# Altium schematic sheet Project_Overview.SchDoc
size A4; Organization: Arribada Initiative; Address1: https://github.com/arribada; Address2: contact@arribada.org; Address3: arribada.org; Address4: UK - Portsmouth; DocumentNumber: 1; SheetNumber: 1; SheetTotal: 12
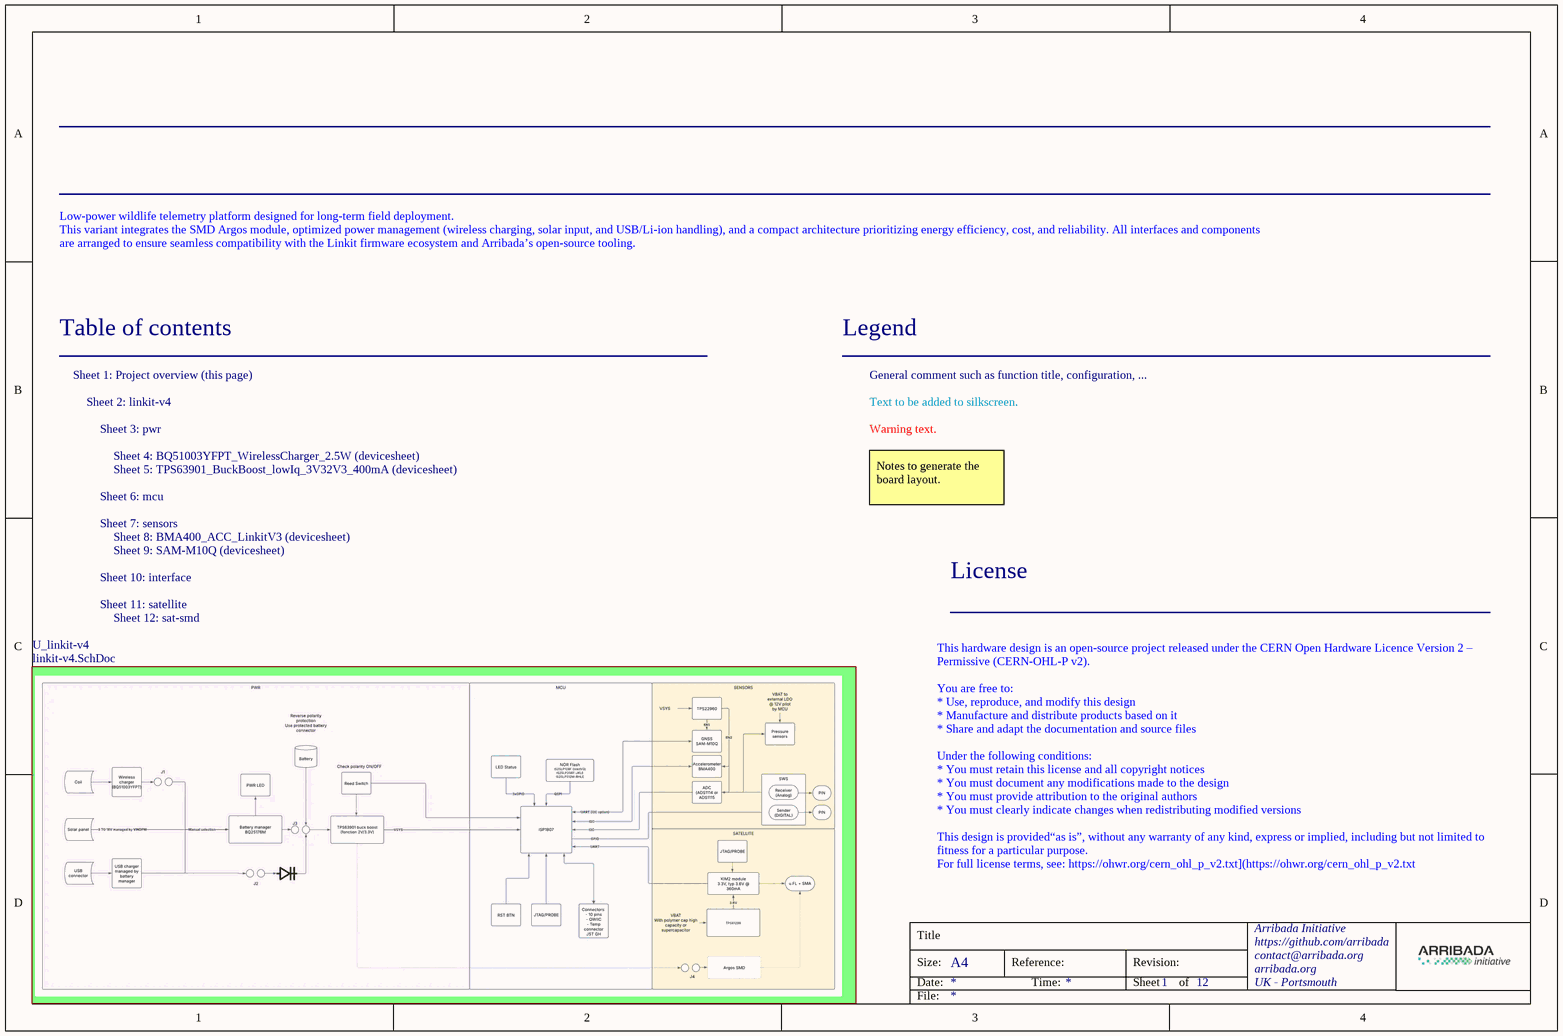
[diagram p0: Project_Overview.SchDoc]

## Sub-sheets
U_linkit-v4 = linkit-v4.SchDoc: no entries

## Notes on the sheet
- Low-power wildlife telemetry platform designed for long-term field deployment.
  This variant integrates the SMD Argos module, optimized power management (wireless charging, solar input, and USB/Li-ion handling), and a compact architecture prioritizing energy efficiency, cost, and reliability. All interfaces and components are arranged to ensure seamless compatibility with the Linkit firmware ecosystem and Arribada’s open-source tooling.
- Table of contents
- Sheet 1: Project overview (this page)
- Legend
- General comment such as function title, configuration, ...
- Sheet 2: linkit-v4
- Sheet 3: pwr
- Text to be added to silkscreen.
- Warning text.
- Sheet 6: mcu
- Sheet 4: BQ51003YFPT_WirelessCharger_2.5W (devicesheet)
- Sheet 5: TPS63901_BuckBoost_lowIq_3V32V3_400mA (devicesheet)
- Notes to generate the board layout.
- Sheet 7: sensors
- Sheet 10: interface
- Sheet 8: BMA400_ACC_LinkitV3 (devicesheet)
- Sheet 9: SAM-M10Q (devicesheet)
- License
- Sheet 11: satellite
- Sheet 12: sat-smd
- This hardware design is an open-source project released under the CERN Open Hardware Licence Version 2 – Permissive (CERN-OHL-P v2).
  You are free to:
  * Use, reproduce, and modify this design
  * Manufacture and distribute products based on it
  * Share and adapt the documentation and source files
  Under the following conditions:
  * You must retain this license and all copyright notices
  * You must document any modifications made to the design
  * You must provide attribution to the original authors
  * You must clearly indicate changes when redistributing modified versions
  This design is provided“as is”, without any warranty of any kind, express or implied, including but not limited to fitness for a particular purpose.
  For full license terms, see: https://ohwr.org/cern_ohl_p_v2.txt](https://ohwr.org/cern_ohl_p_v2.txt
  Attribution
  Designed and developed by **Arribada Initiative**
  https://arribada.org
- Title
- Size:
- Date:
- A4
- Reference:
- Time:
- Revision:
- Sheet
- of
- File: